# EAGLE design choobMatrix (EAGLE 9.0.1)

## Sheet 1 of 2
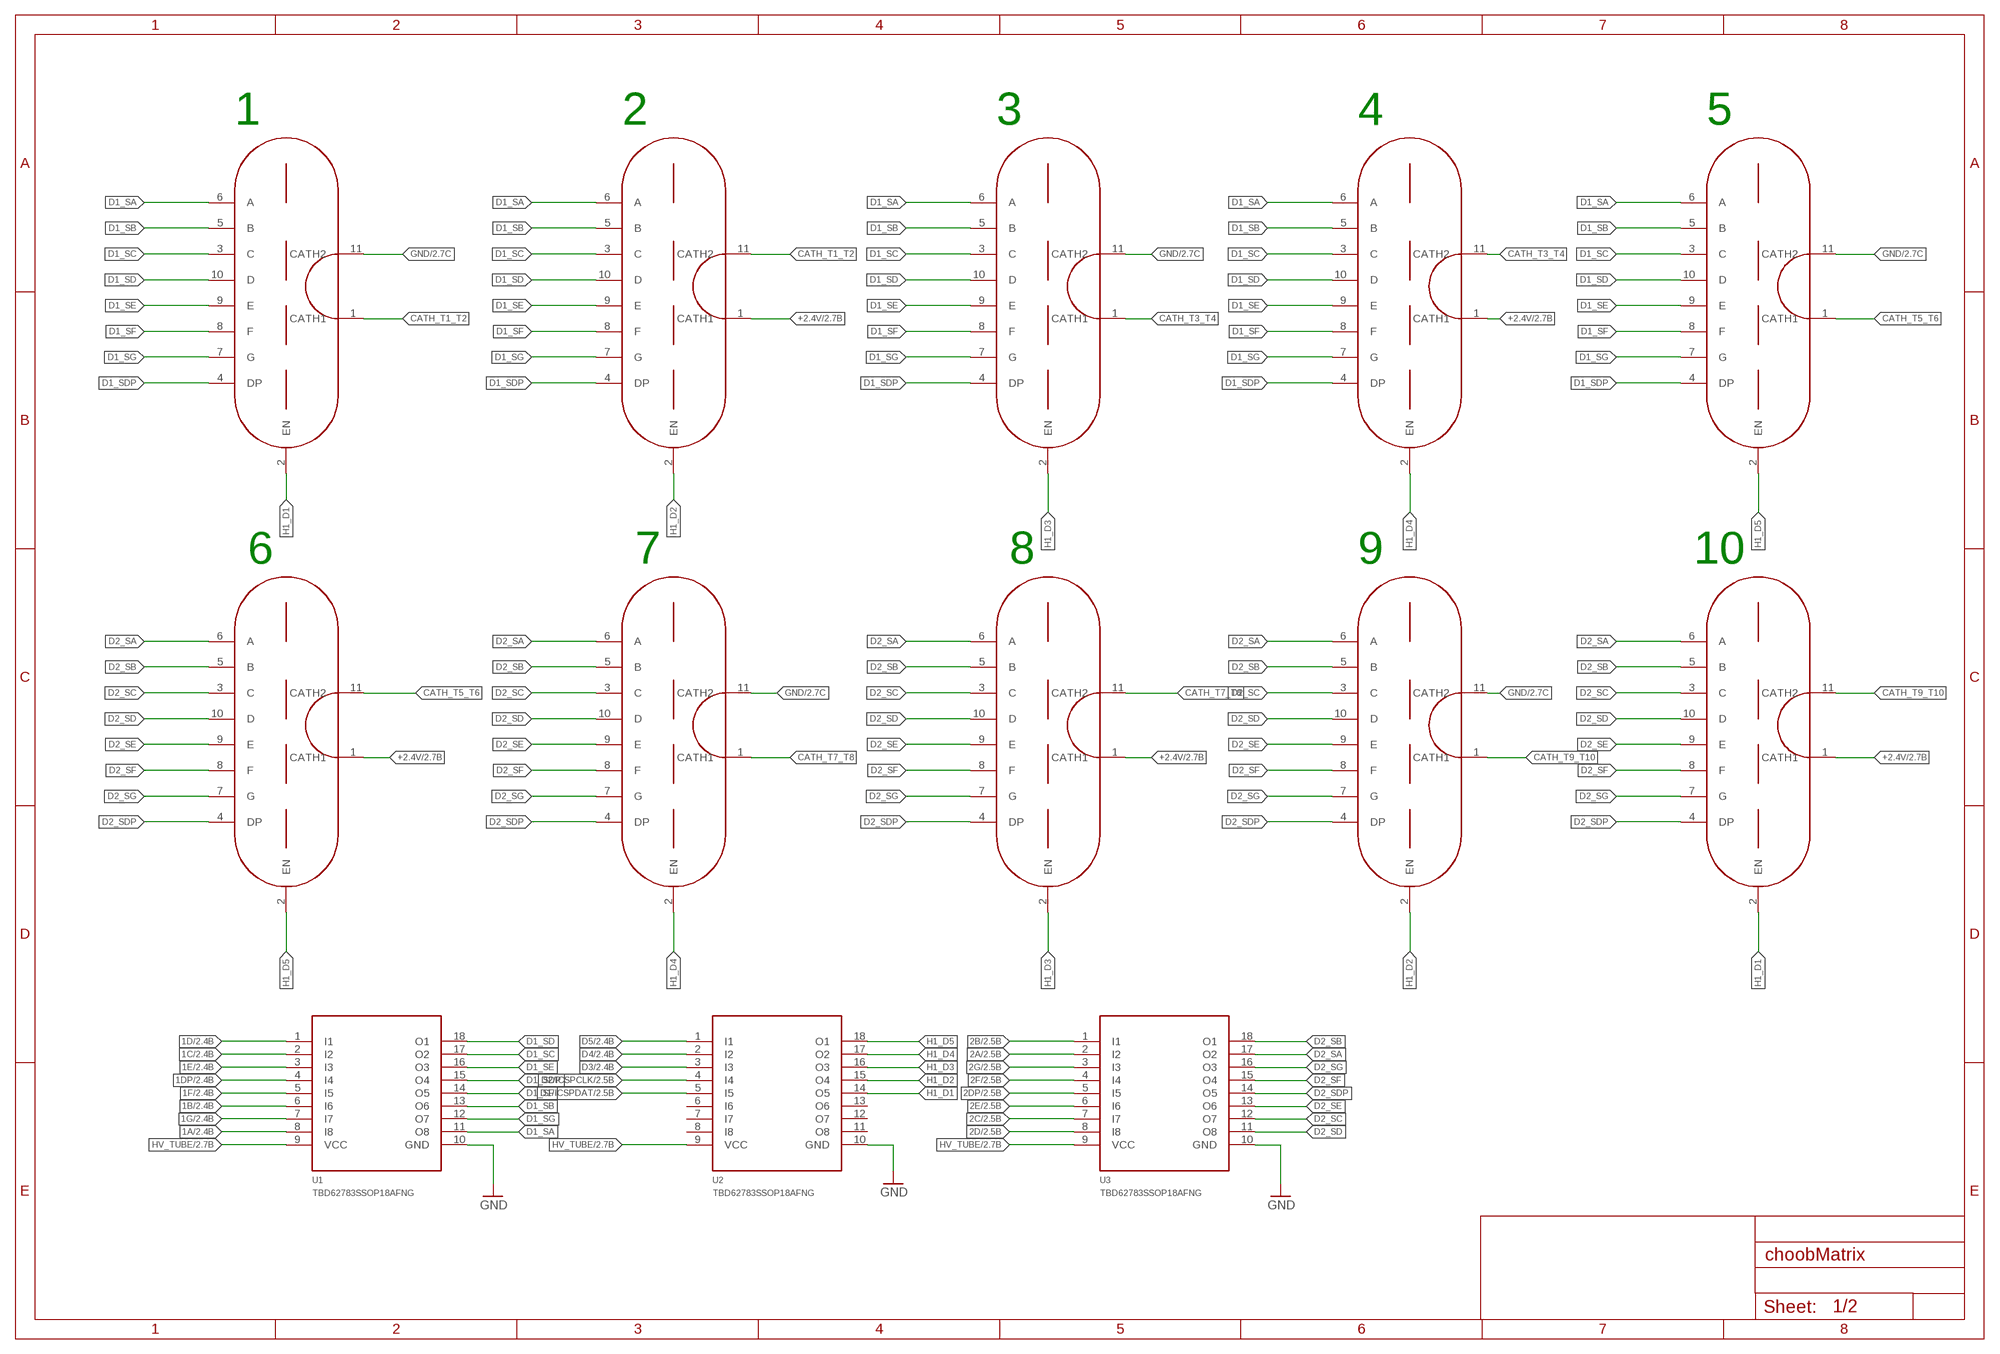
[diagram p0: schematic, sheet 1]

### Parts
T1  IV11  [IV11]
T2  IV11  [IV11]
T3  IV11  [IV11]
T4  IV11  [IV11]
T5  IV11  [IV11]
T6  IV11  [IV11]
T7  IV11  [IV11]
T8  IV11  [IV11]
T9  IV11  [IV11]
T10  IV11  [IV11]
U1  TBD62783SSOP18AFNG  [SOP65P640X15-18]
U2  TBD62783SSOP18AFNG  [SOP65P640X15-18]
U3  TBD62783SSOP18AFNG  [SOP65P640X15-18]

### Nets
1A: U1.8(I8) ; also sheet 2
1B: U1.6(I6) ; also sheet 2
1C: U1.2(I2) ; also sheet 2
1D: U1.1(I1) ; also sheet 2
1DP: U1.4(I4) ; also sheet 2
1E: U1.3(I3) ; also sheet 2
1F: U1.5(I5) ; also sheet 2
1G: U1.7(I7) ; also sheet 2
2A: U3.2(I2) ; also sheet 2
2B: U3.1(I1) ; also sheet 2
2C: U3.7(I7) ; also sheet 2
2D: U3.8(I8) ; also sheet 2
2DP: U3.5(I5) ; also sheet 2
2E: U3.6(I6) ; also sheet 2
2F: U3.4(I4) ; also sheet 2
2G: U3.3(I3) ; also sheet 2
+2.4V: T2.1(CATH1) T4.1(CATH1) T6.1(CATH1) T8.1(CATH1) T10.1(CATH1) ; also sheet 2
CATH_T1_T2: T1.1(CATH1) T2.11(CATH2)
CATH_T3_T4: T3.1(CATH1) T4.11(CATH2)
CATH_T5_T6: T5.1(CATH1) T6.11(CATH2)
CATH_T7_T8: T7.1(CATH1) T8.11(CATH2)
CATH_T9_T10: T9.1(CATH1) T10.11(CATH2)
D1/ICSPDAT: U2.5(I5) ; also sheet 2
D1_SA: T1.6(A) T2.6(A) T3.6(A) T4.6(A) T5.6(A) U1.11(O8)
D1_SB: T1.5(B) T2.5(B) T3.5(B) T4.5(B) T5.5(B) U1.13(O6)
D1_SC: T1.3(C) T2.3(C) T3.3(C) T4.3(C) T5.3(C) U1.17(O2)
D1_SD: T1.10(D) T2.10(D) T3.10(D) T4.10(D) T5.10(D) U1.18(O1)
D1_SDP: T1.4(DP) T2.4(DP) T3.4(DP) T4.4(DP) T5.4(DP) U1.15(O4)
D1_SE: T1.9(E) T2.9(E) T3.9(E) T4.9(E) T5.9(E) U1.16(O3)
D1_SF: T1.8(F) T2.8(F) T3.8(F) T4.8(F) T5.8(F) U1.14(O5)
D1_SG: T1.7(G) T2.7(G) T3.7(G) T4.7(G) T5.7(G) U1.12(O7)
D2/ICSPCLK: U2.4(I4) ; also sheet 2
D2_SA: T6.6(A) T7.6(A) T8.6(A) T9.6(A) T10.6(A) U3.17(O2)
D2_SB: T6.5(B) T7.5(B) T8.5(B) T9.5(B) T10.5(B) U3.18(O1)
D2_SC: T6.3(C) T7.3(C) T8.3(C) T9.3(C) T10.3(C) U3.12(O7)
D2_SD: T6.10(D) T7.10(D) T8.10(D) T9.10(D) T10.10(D) U3.11(O8)
D2_SDP: T6.4(DP) T7.4(DP) T8.4(DP) T9.4(DP) T10.4(DP) U3.14(O5)
D2_SE: T6.9(E) T7.9(E) T8.9(E) T9.9(E) T10.9(E) U3.13(O6)
D2_SF: T6.8(F) T7.8(F) T8.8(F) T9.8(F) T10.8(F) U3.15(O4)
D2_SG: T6.7(G) T7.7(G) T8.7(G) T9.7(G) T10.7(G) U3.16(O3)
D3: U2.3(I3) ; also sheet 2
D4: U2.2(I2) ; also sheet 2
D5: U2.1(I1) ; also sheet 2
GND: T1.11(CATH2) T3.11(CATH2) T5.11(CATH2) T7.11(CATH2) T9.11(CATH2) U1.10(GND) U2.10(GND) U3.10(GND) ; also sheet 2
H1_D1: T1.2(EN) T10.2(EN) U2.14(O5)
H1_D2: T2.2(EN) T9.2(EN) U2.15(O4)
H1_D3: T3.2(EN) T8.2(EN) U2.16(O3)
H1_D4: T4.2(EN) T7.2(EN) U2.17(O2)
H1_D5: T5.2(EN) T6.2(EN) U2.18(O1)
HV_TUBE: U1.9(VCC) U2.9(VCC) U3.9(VCC) ; also sheet 2
Unconnected: U2.6(I6) U2.7(I7) U2.8(I8) U2.11(O8) U2.12(O7) U2.13(O6)

### Notes on the sheet
- 1 | 2 | 3 | 4 | 5
- 6 | 7 | 8 | 9 | 10

## Sheet 2 of 2
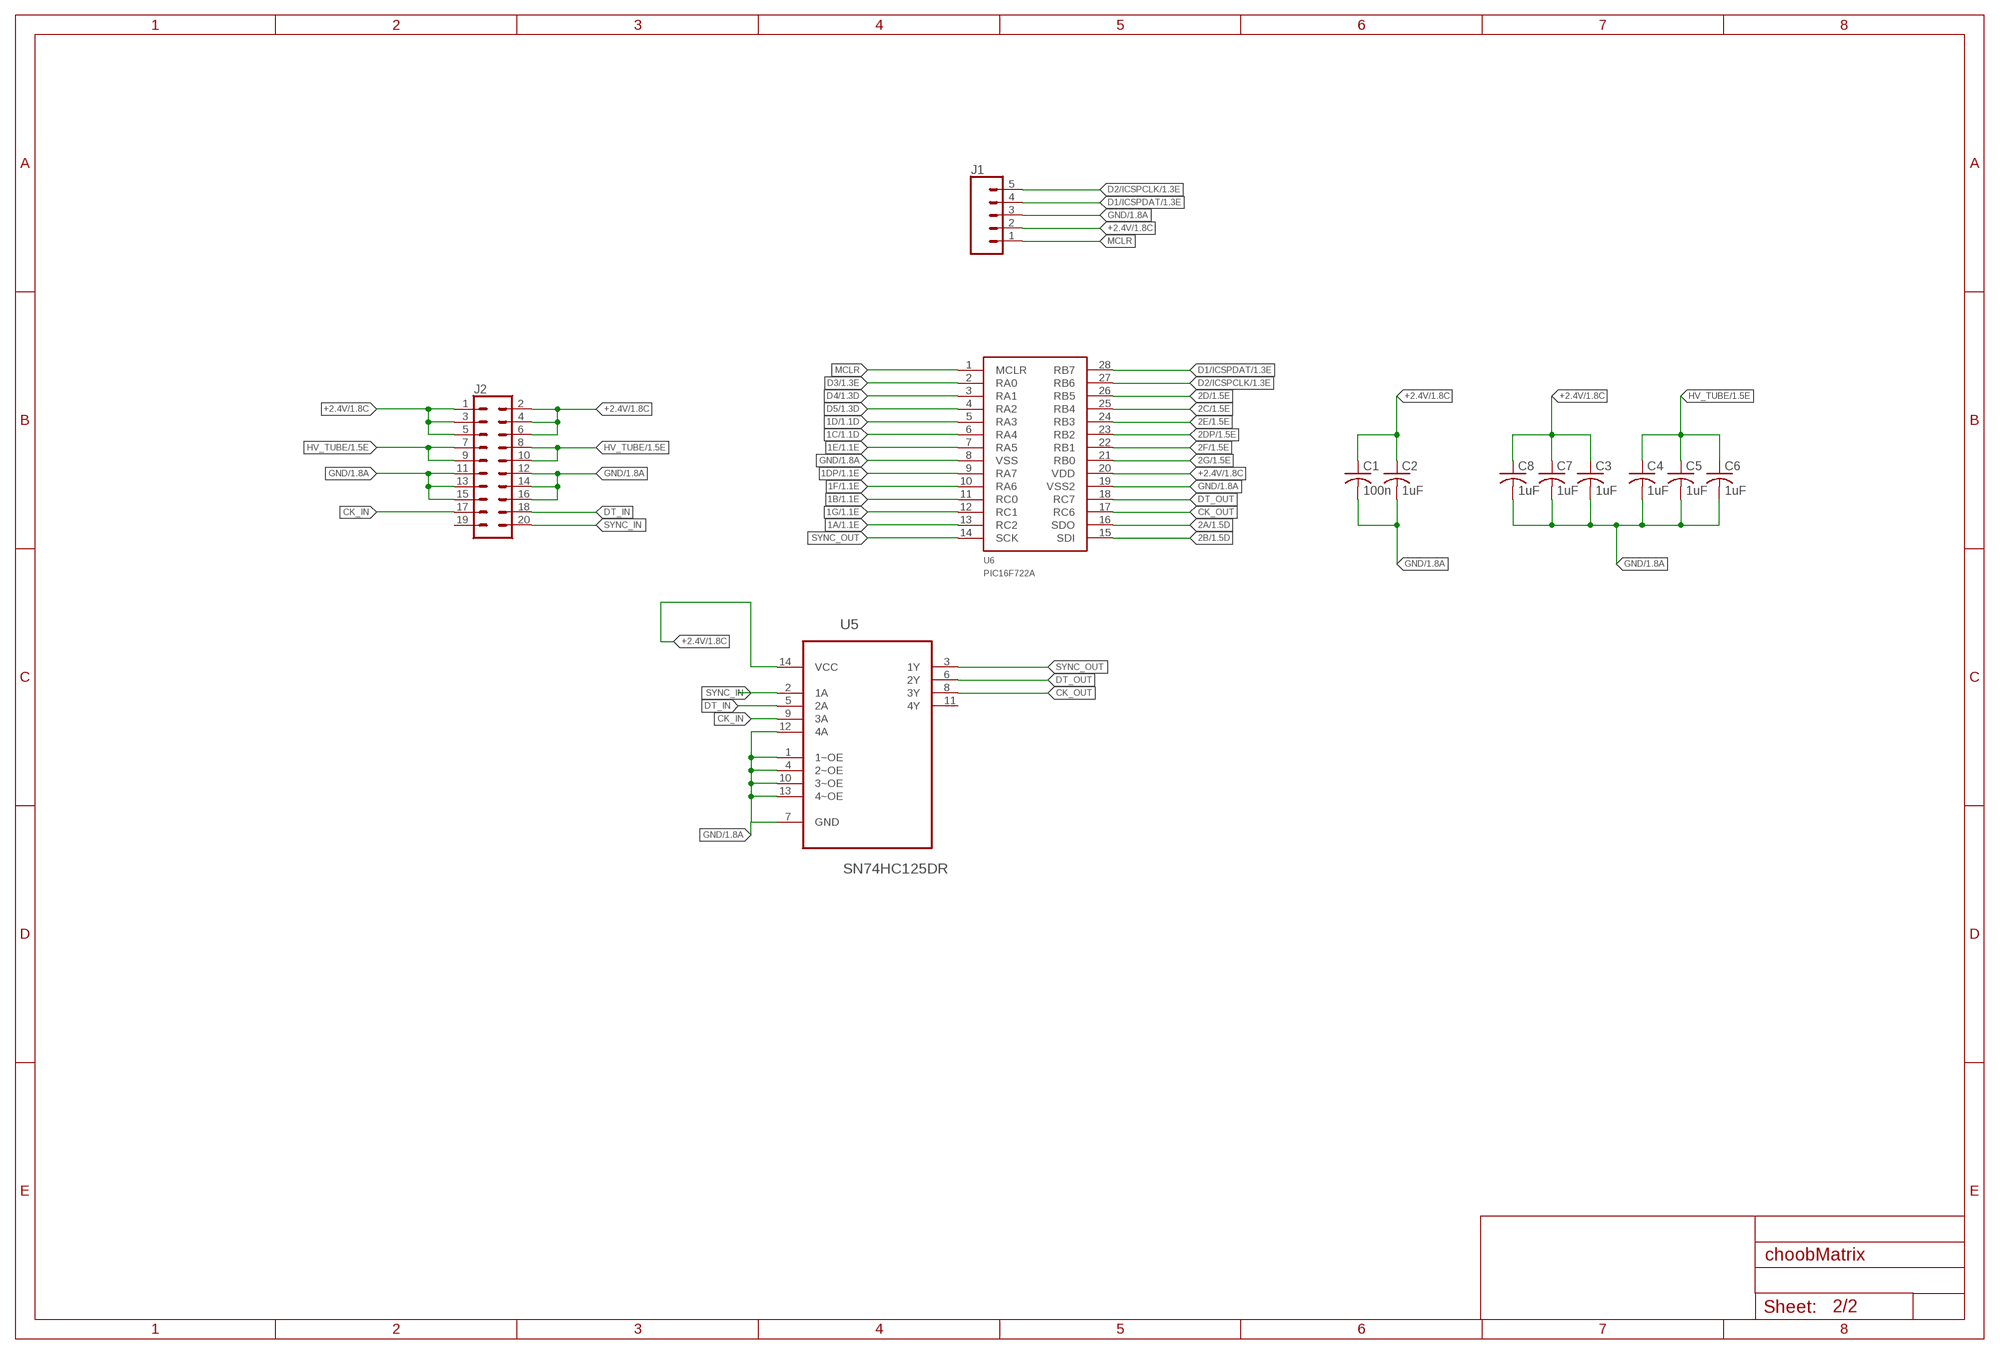
[diagram p1: schematic, sheet 2]

### Parts
C1  100n  C-USC0805K  [C0805K]
C2  1uF  C-USC0805K  [C0805K]
C3  1uF  C-USC0805K  [C0805K]
C4  1uF  C-USC0805K  [C0805K]
C5  1uF  C-USC0805K  [C0805K]
C6  1uF  C-USC0805K  [C0805K]
C7  1uF  C-USC0805K  [C0805K]
C8  1uF  C-USC0805K  [C0805K]
J1  CONN_05  [1X05]
J2  CONN_10X2NOSILK  [2X10_NOSILK]
U5  SN74HC125DR  [SOIC127P600X175-14N]
U6  PIC16F722A  [SOP65P780X200-28N]

### Nets
1A: U6.13(RC2) ; also sheet 1
1B: U6.11(RC0) ; also sheet 1
1C: U6.6(RA4) ; also sheet 1
1D: U6.5(RA3) ; also sheet 1
1DP: U6.9(RA7) ; also sheet 1
1E: U6.7(RA5) ; also sheet 1
1F: U6.10(RA6) ; also sheet 1
1G: U6.12(RC1) ; also sheet 1
2A: U6.16(SDO) ; also sheet 1
2B: U6.15(SDI) ; also sheet 1
2C: U6.25(RB4) ; also sheet 1
2D: U6.26(RB5) ; also sheet 1
2DP: U6.23(RB2) ; also sheet 1
2E: U6.24(RB3) ; also sheet 1
2F: U6.22(RB1) ; also sheet 1
2G: U6.21(RB0) ; also sheet 1
+2.4V: C1.1 C2.1 C3.1 C7.1 C8.1 J1.2 J2.1 J2.2 J2.3 J2.4 J2.5 J2.6 U5.14(VCC) U6.20(VDD) ; also sheet 1
CK_IN: J2.17 U5.9(3A)
CK_OUT: U5.8(3Y) U6.17(RC6)
D1/ICSPDAT: J1.4 U6.28(RB7) ; also sheet 1
D2/ICSPCLK: J1.5 U6.27(RB6) ; also sheet 1
D3: U6.2(RA0) ; also sheet 1
D4: U6.3(RA1) ; also sheet 1
D5: U6.4(RA2) ; also sheet 1
DT_IN: J2.18 U5.5(2A)
DT_OUT: U5.6(2Y) U6.18(RC7)
GND: C1.2 C2.2 C3.2 C4.2 C5.2 C6.2 C7.2 C8.2 J1.3 J2.11 J2.12 J2.13 J2.14 J2.15 J2.16 U5.1(1~OE) U5.4(2~OE) U5.7(GND) U5.10(3~OE) U5.12(4A) U5.13(4~OE) U6.8(VSS) U6.19(VSS2) ; also sheet 1
HV_TUBE: C4.1 C5.1 C6.1 J2.7 J2.8 J2.9 J2.10 ; also sheet 1
MCLR: J1.1 U6.1(MCLR)
SYNC_IN: J2.20 U5.2(1A)
SYNC_OUT: U5.3(1Y) U6.14(SCK)
Unconnected: J2.19 U5.11(4Y)

## Library data of the parts
C1-C8 = rcl:C-US: CAPACITOR, American symbol; SPICEPREFIX: C
J1 = SparkFun-Connectors:CONN_05: Multi connection point. Often used as Generic Header-pin footprint for 0.1 inch spaced/style header connections On any of the 0.1 inch spaced packages, you can populate with these: Break Away Headers - Straight <https://www.sparkfun.com/products/116> (PRT-00116) Break Away Male Headers - Right Angle <https://www.sparkfun.com/products/553> (PRT-00553) Female Headers <https://www.sparkfun.com/products/115> (PRT-00115) Break Away Headers - Machine Pin <https://www.sparkfun.com/products/117> (PRT-00117) Break Away Female Headers - Swiss Machine Pin <https://www.sparkfun.com/products/743> (PRT-00743) For SCREWTERMINALS and SPRING TERMINALS visit here: Screw Terimnals on SparkFun.com <https://www.sparkfun.com/search/results?term=Screw+Terminals> (5mm/3.5mm/2.54mm spacing) This device is also useful as a general connection point to wire up your design to another part of your project. Our various solder wires solder well into these plated through hole pads. Hook-Up Wire - Assortment (Stranded, 22 AWG) <https://www.sparkfun.com/products/11375> (PRT-11375) Hook-Up Wire - Assortment (Solid Core, 22 AWG) <https://www.sparkfun.com/products/11367> (PRT-11367) View the entire wire category on our website here <https://www.sparkfun.com/categories/141> Special notes: Molex polarized connector foot print use with SKU : PRT-08231 with associated crimp pins and housings. 1MM SMD Version SKU: PRT-10208
J2 = SparkFun-Connectors:CONN_10X2: Multi connection point. Often used as Generic Header-pin footprint for 0.1 inch spaced/style header connections On any of the 0.1 inch spaced packages, you can populate with these: Break Away Headers - Straight <https://www.sparkfun.com/products/116> (PRT-00116) Break Away Male Headers - Right Angle <https://www.sparkfun.com/products/553> (PRT-00553) Female Headers <https://www.sparkfun.com/products/115> (PRT-00115) Break Away Headers - Machine Pin <https://www.sparkfun.com/products/117> (PRT-00117) Break Away Female Headers - Swiss Machine Pin <https://www.sparkfun.com/products/743> (PRT-00743) Special note about the "SPECIAL" package: This was SPECIALLY designed to be used with our Graphic LCD Backpack. Be sure you want to use this! It is not only staggered on each line of header holes, but IT IS ALSO offset of the center point of the top and bottom lines by 5 mil. This causes the headers to lock into place on the "standard" footprint on the LCD screen. The extra squares on the tdocu layer are there simply to reference other pins (if you were to actually populate a longer header than ten long - this is what we do with the backpacks).
T1-T10 = iv11:IV11
U1-U3 = SSOP18:TBD62783
U5 = driver:SN74HC125DR: QUADRUPLE BUS BUFFER GATES WITH 3-STATE OUTPUTS; AVAILABILITY: Good; DESCRIPTION: Quadruple Bus Buffer Gates With 3-State Outputs 14-SOIC -40 to 85; MF: Texas Instruments; MP: SN74HC125DR; PACKAGE: SOIC-14 Texas Instruments; PRICE: 0.17 USD
U6 = SOP65P780X200-28N:PIC16F722A

## Board
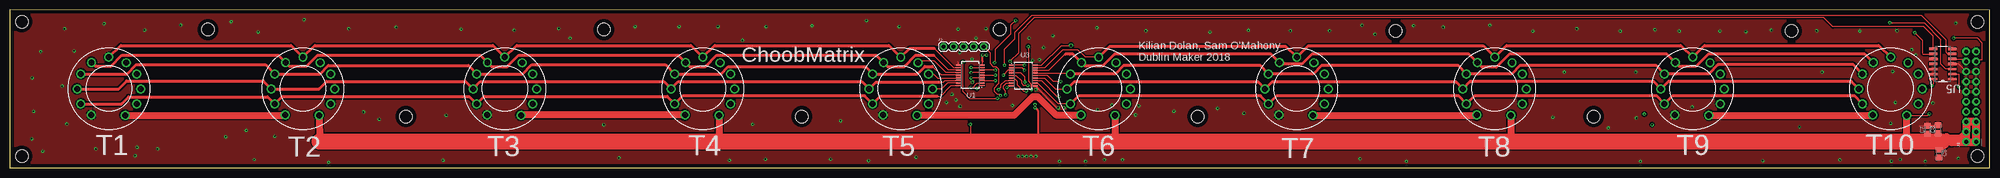
[diagram p2: board, top side]
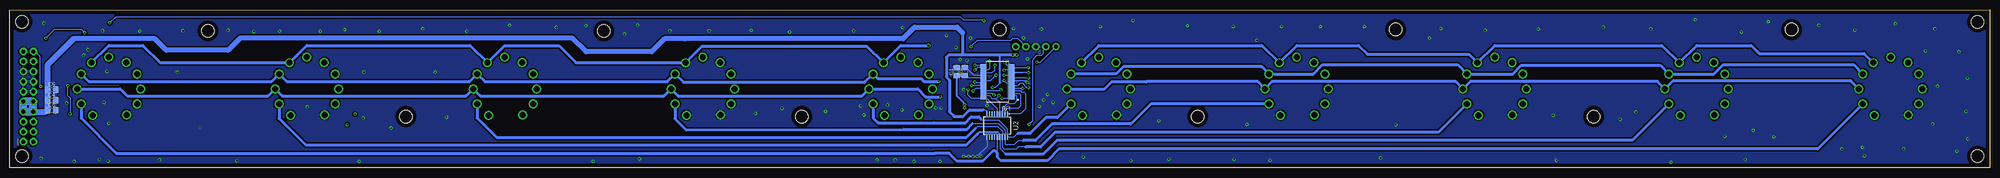
[diagram p3: board, bottom side, seen from below]

Size 500 x 40 mm. Coordinates in mm from the lower left corner, seen from the top.
Outline: 0,0 500,0 499.99,39.97 0,40 0,0
Copper layers (1*16): Top 0.035mm / dielectric 1.5mm / Bottom 0.035mm
Design rules "default *": minimum track width 6mil, minimum drill 0.35mm, track to track 13mil, track to pad 6mil, pad to pad 6mil, via to via 12mil, smd to smd 6mil, copper to edge 40mil, drill to drill 6mil, minimum pad ring 10mil, minimum via ring 8mil, stop-mask expansion 4mil, vias tented up to drill 0mil, thermal gap 10mil
Holes 3.2 mm at 497,3 497,37 3,3 3,37 50,35 100,13 150,35 200,13 250,35 300,13 350,34.7 400,13 450,34.7

### Footprints (pad centres in the part's own frame; a part is rotated, then mirrored left to right if it is on the bottom)
C0805K = smd 1.3 x 1.6: 1 -1,0; 2 1,0
1X05 = drill 1.016 pad 1.88: 1 0,0; 2 2.54,0; 3 5.08,0; 4 7.62,0; 5 10.16,0
2X10_NOSILK = drill 1.016 pad 1.88: 1 0,0; 2 0,2.54; 3 2.54,0; 4 2.54,2.54; 5 5.08,0; 6 5.08,2.54; 7 7.62,0; 8 7.62,2.54; 9 10.16,0; 10 10.16,2.54; 11 12.7,0; 12 12.7,2.54; 13 15.24,0; 14 15.24,2.54; 15 17.78,0; 16 17.78,2.54; 17 20.32,0; 18 20.32,2.54; 19 22.86,0; 20 22.86,2.54
IV11 = drill 1.5: 1 4.1,-6.7; 2 7,-3.8; 3 8,0; 4 7,3.8; 5 4.4,6.6; 6 0,8; 7 -4.4,6.7; 8 -7.1,3.8; 9 -8,0; 10 -7.1,-3.8; 11 -4.5,-6.6
SOP65P640X15-18 = smd 1.229 x 0.302: 1 -2.991,2.6; 2 -2.991,1.95; 3 -2.991,1.3; 4 -2.991,0.65; 5 -2.991,0; 6 -2.991,-0.65; 7 -2.991,-1.3; 8 -2.991,-1.95; 9 -2.991,-2.6; 10 2.991,-2.6; 11 2.991,-1.95; 12 2.991,-1.3; 13 2.991,-0.65; 14 2.991,0; 15 2.991,0.65; 16 2.991,1.3; 17 2.991,1.95; 18 2.991,2.6
SOIC127P600X175-14N = smd 2.057 x 0.61: 1 -4.801,7.62; 2 -4.801,6.35; 3 -4.801,5.08; 4 -4.801,3.81; 5 -4.801,2.54; 6 -4.801,1.27; 7 -4.801,0; 8 0,0; 9 0,1.27; 10 0,2.54; 11 0,3.81; 12 0,5.08; 13 0,6.35; 14 0,7.62
SOP65P780X200-28N = smd 1.651 x 0.432: 1 -3.505,4.225; 2 -3.505,3.575; 3 -3.505,2.925; 4 -3.505,2.275; 5 -3.505,1.625; 6 -3.505,0.975; 7 -3.505,0.325; 8 -3.505,-0.325; 9 -3.505,-0.975; 10 -3.505,-1.625; 11 -3.505,-2.275; 12 -3.505,-2.925; 13 -3.505,-3.575; 14 -3.505,-4.225; 15 3.505,-4.225; 16 3.505,-3.575; 17 3.505,-2.925; 18 3.505,-2.275; 19 3.505,-1.625; 20 3.505,-0.975; 21 3.505,-0.325; 22 3.505,0.325; 23 3.505,0.975; 24 3.505,1.625; 25 3.505,2.275; 26 3.505,2.925; 27 3.505,3.575; 28 3.505,4.225

### Placement (x,y rotation side)
C1  260.9,24.4 90 bottom
C2  258.8,24.4 90 bottom
C3  487,9.8 90 top
C4  489.4,17.1 0 bottom
C5  489.4,19.8 0 bottom
C6  489.4,14.6 0 bottom
C7  484.3,9.7 90 top
C8  487.2,3.6 270 top
J1  235.8,30.7 0 top
J2  496.6,6.6 90 top
T1  25,20 0 top
T2  74,20 0 top
T3  125,20 0 top
T4  175,20 0 top
T5  225,20 0 top
T6  275,20 0 top
T7  325,20 0 top
T8  375,20 0 top
T9  425,20 0 top
T10  475,20 0 top
U1  242.58,23.45 180 top
U2  250.65,10.69 270 bottom
U3  255.9,23.4 0 top
U5  485.8,30.1 180 top
U6  250.6,21.8 180 bottom

### Tracks (layer width: path | path; a pad name or v marks a point on that pad's centre or on a via)
1A  (via drill 0.35)
  Top 0.3: v242.8,25.4 U1.8
  Bottom 0.3: U6.13 242.82,25.38 v242.8,25.4
1B  (via drill 0.35)
  Top 0.3: 243.7,24.1 U1.6 v242.8,24.1
  Bottom 0.3: 244.18,24.07 U6.11 242.82,24.07 v242.8,24.1
1C  (via drill 0.35)
  Top 0.3: U1.2 244.3,21.5 243.2,20.4 v242.8,20.4
  Bottom 0.3: U6.6 245.38,20.82 244.7,21.5 244.3,21.5 243.2,20.4 v242.8,20.4
1D  (via drill 0.35)
  Top 0.3: v244.2,20.1 244.95,20.85 U1.1
  Bottom 0.3: U6.5 244.28,20.18 v244.2,20.1
1DP  (via drill 0.35)
  Top 0.3: U1.4 244.2,22.8 v242.8,22.8
  Bottom 0.3: v242.8,22.8 247.07,22.8 U6.9
1E  (via drill 0.35)
  Top 0.3: U1.3 246.7,22.15 247.1,22.15 248.85,22.15 v248.9,22.1
  Bottom 0.3: v248.9,22.1 248.28,21.48 U6.7
1F  (via drill 0.35)
  Top 0.3: U1.5 248.85,23.45 v248.9,23.5
  Bottom 0.3: U6.10 248.82,23.43 v248.9,23.5
1G  (via drill 0.35)
  Top 0.3: v248.9,24.7 248.85,24.75 U1.7
  Bottom 0.3: U6.12 248.88,24.73 v248.9,24.7
2A  (via drill 0.35)
  Top 0.3: U3.2 255.65,25.35 v256.3,24.7
  Bottom 0.3: U6.16 255.62,25.38 v256.3,24.7
2B  (via drill 0.35)
  Top 0.3: v256.3,26 U3.1
  Bottom 0.3: v256.3,26 256.27,26.02 U6.15
2C  (via drill 0.35)
  Top 0.3: U3.7 251.4,22.1 250.36,21.06 250.36,21.03 250.34,21.01 250.34,20.44 v249.7,19.8
  Bottom 0.3: v249.7,19.8 249.97,19.52 U6.25
2D  (via drill 0.35)
  Top 0.3: U3.8 251.67,21.45 250.97,20.75 250.97,20.05 251.5,19.52 v251.5,18.4
  Bottom 0.3: v251.5,18.4 251.97,18.88 U6.26
2DP  (via drill 0.35)
  Top 0.3: v257.1,20.9 256,20.9 255.45,21.45 255.45,22.05 254.1,23.4 U3.5
  Bottom 0.3: U6.23 257.02,20.82 v257.1,20.9
2E  (via drill 0.35)
  Top 0.3: U3.6 253.65,22.75 254.4,22 254.4,21.1 256,19.5 v256.7,19.5
  Bottom 0.3: v256.7,19.5 256.02,20.18 U6.24
2F  (via drill 0.35)
  Top 0.3: U3.4 255.35,24.05 256.35,23.05 v256.35,21.73
  Bottom 0.3: v256.35,21.73 256.09,21.48 U6.22
2G  (via drill 0.35)
  Top 0.3: U3.3 252.1,24.7 v250.9,23.5
  Bottom 0.3: v250.9,23.5 252.29,22.11 U6.21
+2.4V  (via drill 0.35)
  Top 0.3: 487.2,4.9 C8.1 | 488,6.7 486.3,6.7 C7.1 | C3.1 487,8 485.7,6.7 | v242.6,11 242.6,6.7 | T10.1 484.4,13.3 v484.8,13.7 | U5.14 485.8,21.25 v485.35,20.8
  Top 0.5: 259.6,7.6 259.6,14.5 v258.9,15.2 v258.9,16 | 259.6,7.6 259.3,7.3 | 259.6,7.6 259.6,6.9 259.4,6.7
  Top 1.3: J2.4 492.62,7.7 489.2,7.7 489.1,7.8 | 488,6.7 487.2,5.9 487.2,4.9
  Top 1.8: T2.1 78.2,6.7 | 479.1,6.7 T10.1 | T8.1 379.1,6.9 378.9,6.7 | T6.1 279.1,7 279.4,6.7 | T4.1 179.1,6.8 179.2,6.7
  Top 2: 488,6.7 490.46,6.7 J2.2 J2.4 J2.6 J2.5 J2.3 J2.1 490.4,6.5 489.1,7.8
  Top 4: 78.2,6.7 179.2,6.7 242.6,6.7 259.4,6.7 279.4,6.7 378.9,6.7 479.1,6.7 485.7,6.7 488,6.7
  Bottom 0.3: J1.2 239.07,29.97 239.07,28.86 239.56,28.37 240.67,28.37 241.7,27.34 241.7,11.9 v242.6,11 | 254.38,22.74 254.37,22.75 254.1,22.75 U6.20 258.18,22.77 C2.1 | v484.8,13.7 484.8,17.7 485.35,18.25 v485.35,20.8
  Bottom 0.5: C2.1 C1.1 260.9,18.3 258.9,16.3 v258.9,16
CATH_T1_T2
  Top 1.8: T1.1 69.4,13.3 T2.11
CATH_T3_T4
  Top 1.8: T4.11 129.2,13.4 T3.1
CATH_T5_T6
  Top 1.8: T6.11 264.2,13.4 259.6,18 258.3,18 253.6,13.3 T5.1
CATH_T7_T8
  Top 1.8: T7.1 370.4,13.3 T8.11
CATH_T9_T10
  Top 1.8: T9.1 470.4,13.3 T10.11
CK_IN  (via drill 0.35)
  Top 0.3: J2.17 497.08,27.4 498.2,27.4 498.2,31.6 497,32.8 v490.9,32.8 | v481.1,34.2 483,32.3 483,29 483.17,28.83 U5.9
  Bottom 0.3: v481.1,34.2 481.85,34.95 488.75,34.95 v490.9,32.8
CK_OUT  (via drill 0.35)
  Top 0.3: v252.6,27 254.7,29.1 254.7,34 258.7,38 458.1,38 460.4,35.7 483.4,35.7 485.8,33.3 U5.8
  Bottom 0.3: v252.6,27 252.6,25.1 253,24.7 254.09,24.7 U6.17
D1/ICSPDAT  (via drill 0.35)
  Top 0.3: v257.2,30.7 257.2,21.98 257.93,21.25 257.93,19.97 v258,19.9
  Bottom 0.3: J1.4 245.42,32.7 246.8,32.7 247.3,32.2 255.8,32.2 257.2,30.8 v257.2,30.7 | v258,19.9 258,18.4 257.18,17.57 U6.28 253.2,17.57 250.65,15.03 U2.5
D1_SA
  Top 0.3: 233.4,30.3 238.3,25.4 U1.11
  Top 0.8: T1.6 28,31 71,31 T2.6 77,31 122,31 T3.6 128,31 172,31 T4.6 178,31 222,31 T5.6 227.3,30.3 233.4,30.3
D1_SB
  Top 0.3: T5.5 229.8,27 233.5,27 236.4,24.1 U1.13
  Bottom 0.8: T5.5 225,31 183.8,31 T4.5 175,31 159.4,31 157.15,28.75 131.55,28.75 T3.5 125,31 82.8,31 T2.5 74,31 60.2,31 58.15,28.95 31.75,28.95 T1.5
D1_SC
  Top 0.3: U1.17 236.8,21.5 235.3,20 T5.3
  Bottom 0.8: T5.3 223.5,20 221.8,21.7 213,21.7 212.9,21.8 184.8,21.8 T4.3 181.2,21.8 134.8,21.8 T3.3 131.1,21.9 83.9,21.9 T2.3 80,22 35,22 T1.3
D1_SD
  Top 0.3: 234.2,18.1 235,18.1 237.75,20.85 U1.18
  Top 0.8: T1.10 28.2,16.2 30,18 65.1,18 T2.10 68.7,18 116.1,18 T3.10 119.8,18.1 166,18.1 T4.10 169.9,18.2 215.9,18.2 T5.10 219.8,18.1 234.2,18.1
D1_SDP
  Top 0.3: U1.15 234.3,22.8 233.3,23.8 T5.4
  Bottom 0.8: T5.4 220.6,23.8 218.8,25.6 183.8,25.6 T4.4 170.8,23.8 168.5,26.1 134.3,26.1 T3.4 120.4,23.8 118.2,26 83.2,26 T2.4 69.6,23.8 67.3,26.1 34.3,26.1 T1.4
D1_SE
  Top 0.3: U1.16 236.2,22.15 235.75,21.7 234.7,21.7
  Top 0.8: T1.9 27.5,20 29.5,22 64,22 T2.9 78.1,20 80,21.9 115.1,21.9 T3.9 118.8,21.8 165.2,21.8 T4.9 168.8,21.8 215.2,21.8 T5.9 218.7,21.7 234.7,21.7
D1_SF
  Top 0.3: U1.14 235.25,23.45 233,25.7
  Top 0.8: T1.8 29.6,23.8 31.9,26.1 64.6,26.1 T2.8 78.3,23.8 80.4,25.9 115.8,25.9 T3.8 129.5,23.8 131.8,26.1 165.6,26.1 T4.8 170.5,23.8 179.6,23.8 181.4,25.6 216.1,25.6 T5.8 229.2,23.8 231.1,25.7 233,25.7
D1_SG
  Top 0.3: U1.12 237.05,24.75 233.3,28.5
  Top 0.8: T1.7 21.5,25.8 25.6,25.8 28.3,28.5 67.8,28.5 T2.7 70.5,25.8 75,25.8 77.7,28.5 118.8,28.5 T3.7 121.7,25.6 125.6,25.6 128.5,28.5 168.8,28.5 T4.7 171.6,25.7 175.7,25.7 178.5,28.5 218.8,28.5 T5.7 221.6,25.7 225.9,25.7 228.7,28.5 233.3,28.5
D2/ICSPCLK  (via drill 0.35)
  Top 0.3: v250.2,18.3 249.9,18.6 249.4,18.6 248.7,19.3 248.7,20.26 249.73,21.29 249.73,25.05 249.11,25.67 248.35,25.67 247.53,26.49 247.53,29.13 J1.5
  Bottom 0.3: 251,17.5 251.8,17.5 252.53,18.23 U6.27 | 251,17.5 v250.2,18.3 | U2.4 250,16.5 251,17.5
D2_SA
  Top 0.3: T6.6 271.6,28 269.8,29.8 265.9,29.8 261.45,25.35 U3.17
  Top 0.8: T6.6 277.8,30.8 322.2,30.8 T7.6 327.9,30.9 372.1,30.9 T8.6 378,31 422,31 T9.6 428,31 472,31 T10.6
D2_SB  (via drill 0.5)
  Top 0.3: v268,31 265.6,31 260.6,26 U3.18
  Bottom 0.8: T10.5 475,31 466.4,31 462,26.6 T9.5 425,31 383.8,31 T8.5 375.1,30.9 361.3,30.9 357,26.6 T7.5 325.2,30.8 283.6,30.8 T6.5 275,31 v268,31
D2_SC  (via drill 0.35)
  Top 0.3: U3.12 260.5,22.1 264.6,18 v265,18
  Bottom 0.8: T10.3 472.2,20 470.4,18.2 434.8,18.2 T9.3 431.2,18.2 384.8,18.2 T8.3 381.2,18.2 334.8,18.2 T7.3 331.2,18.2 284.8,18.2 T6.3 270.7,20 268.7,18 v265,18
D2_SD
  Top 0.3: T6.10 264.8,16.2 259.55,21.45 U3.11
  Top 0.8: T6.10 268.65,16.95 269.6,17.9 269.9,18.2 315.9,18.2 T7.10 319.9,18.2 365.9,18.2 T8.10 369.9,18.2 415.9,18.2 T9.10 419.9,18.2 465.9,18.2 T10.10
D2_SDP  (via drill 0.35)
  Top 0.3: U3.14 262.1,23.4 263.6,21.9 v265.4,21.9
  Bottom 0.8: T10.4 480.1,21.9 433.9,21.9 T9.4 430.1,21.9 383.9,21.9 T8.4 380,21.8 334,21.8 T7.4 329.9,21.7 284.1,21.7 T6.4 280.8,22.6 269.78,22.6 269.08,21.9 v265.4,21.9
D2_SE
  Top 0.3: U3.13 261.35,22.75 264.1,20 T6.9
  Top 0.8: T10.9 465.1,21.9 418.9,21.9 T9.9 415.2,21.8 368.8,21.8 T8.9 365.3,21.7 318.7,21.7 T7.9 315.3,21.7 268.7,21.7 T6.9
D2_SF
  Top 0.3: U3.15 267.65,24.05 T6.8
  Top 0.8: 466.2,25.5 T10.8 465.6,26.1 431.4,26.1 429.1,23.8 T9.8 415.8,25.9 381.4,25.9 379.3,23.8 T8.8 365.8,25.9 331.3,25.9 329.2,23.8 T7.8 315.8,25.9 281.3,25.9 279.2,23.8 T6.8
D2_SG
  Top 0.3: U3.16 262.4,24.7 266.5,28.8 267.7,28.8
  Top 0.8: T10.7 468.5,28.8 428.9,28.8 425.8,25.7 421.6,25.7 T9.7 418.5,28.8 378.7,28.8 375.4,25.5 371.8,25.5 T8.7 368.5,28.8 328.8,28.8 326.3,26.3 321,26.3 T7.7 318.5,28.8 279,28.8 276,25.8 271.5,25.8 T6.7 268.5,28.8 267.7,28.8 266.6,28.8
D3
  Bottom 0.3: U2.3 249.35,15.05 248.1,16.3 246.3,16.3 245.7,16.9 245.7,18.2 246.83,18.2 247.07,18.2 U6.2
D4
  Bottom 0.3: U2.2 248.7,14.4 248.1,15 245.4,15 244.7,15.7 244.7,18.6 244.74,18.64 244.81,18.64 245.04,18.88 U6.3
D5
  Bottom 0.3: U2.1 244.72,13.68 243.5,14.9 243.5,18.9 243.87,19.27 244.54,19.27 244.8,19.52 U6.4
DT_IN
  Top 0.3: U5.5 493.42,27.56 J2.18
DT_OUT  (via drill 0.35)
  Top 0.3: v251.2,26 251.2,30.03 253.84,32.66 253.84,34.37 258.17,38.7 482.7,38.7 488.9,32.5 488.9,29.4 489.47,28.83 U5.6
  Bottom 0.3: U6.18 251.93,24.07 251.2,24.8 v251.2,26
GND  (via drill 0.35)
  Top 0.3: v255.7,2.9 v256.8,2.9 | v257.9,2.9 v259.1,2.9 | U3.10 264.49,15.2 v264.8,15.2 | U1.10 239.59,26.71 239.4,26.9 | C7.2 486.9,10.7 482.29,10.51 | J2.16 492.15,26.29 U5.4
  Top 0.6: 419.6,12.5 T9.11
  Bottom 0.3: U2.10 253.25,5.35 v255.7,2.9 | v256.8,2.9 v257.9,2.9 | v259.1,2.9 v254.7,2.9 | U6.8 244.97,22.12 244.96,22.13 243.63,22.13 243,21.5 242.4,21.5 | C2.2 258.5,25.4 256.5,23.41 256.49,23.43 U6.19
  other vias: 354.5,36 362,35.6 373.8,36.1 476.6,34.7 467.2,34.6 456.3,34.7 457.7,24.2 475.5,24.4 481.4,28.5 485.7,16.4 476.2,16.6 475,11.3 477.4,2.1 452,10.4 424.9,15.4 410.8,12.6 410.6,24.2 438.4,34.5 431.9,34.6 421.6,34.6 415.5,35 406.7,34.6 444.9,34.8 384.6,34.6 395.7,35.2 403.7,10.1 389.7,12.8 392.6,24.2 341.5,36.1 344.8,33.8 323.4,34.7 333.3,34.7 312.8,34.8 303.1,34.4 286.9,34.7 274.5,35.5 263.4,33.5 239.5,35.1 244,32.9 224.6,35.8 216.3,37.3 202.6,36 191,35.8 178.8,35.8 169,35.8 157.9,35.8 185,32.3 138.6,35.3 141.5,32.8 127.4,34.8 114,35.1 97.6,35.6 85.6,35.2 74.3,37.5 62.7,34.4 55.9,37 43.1,36.1 23.8,36.5 13.8,35.2 7.8,29.4 34,34.9 16.2,29.6 5.6,22.8 13.2,20.7 6,14.3 14.4,11.1 5.5,7.4 21.7,4.8 8.3,4.2 32.1,5.2 37.3,4.8 54.5,7.9 61.7,2.1 66.9,8 80.5,1.4 93.3,12.3 110.2,13.3 109.4,1.9 150,10.9 153.8,2.5 187.6,11 181.7,1.9 209.8,11.9 207.3,2.2 228.9,2.7 89.3,14.1 59.7,9.5 239.9,29.2 238.9,17.2 281,2 276.4,2 216.9,1.8 190.8,2.2 31.6,3.1 265.1,1.6 271.7,1.6 341,2.3 352.7,1.6 411.8,1.6 462.2,2 442.7,1.8 475.2,1.7 483.8,1.6 492.1,2.4 491.4,36.6 480.3,29.9 246.5,35.3 258.3,27.2 260,27.4 257.4,32.9 261.1,30.5 243,27.6 274.7,14.7 278.4,15.9 284.3,13.4 285.1,15.7 305,15.1 311.7,13.8 294,14.3 243.1,21.7 236.5,16.6 237.9,18.6 240,15.6 266.2,15.2 259.1,19.8 253.2,15.8
  pour Bottom: 500,0 0,0 0,40 500,40
  pour Top: 0,0 71.7,0 499.9,-0.1 500,14.7 500,40 0,40
H1_D1
  Bottom 0.3: U2.14 250.65,4.3 | 250.65,4.3 250.65,3.8 250.65,3.6 | 266.3,3.7 267,3.7 | 251.7,4.3 250.65,4.3
  Bottom 0.8: 37.3,10.9 T1.2 43.4,4.8 235,4.8 238,1.8 249.7,1.8 250.65,2.75 250.65,3.6 | T10.2 482,12.6 473.1,3.7 266.3,3.7 262.8,3.7 260.8,1.7 254.3,1.7 251.7,4.3 251.15,4.3 250.65,3.8
H1_D2
  Bottom 0.3: 248.5,3.5 248.6,3.5 250,4.9 U2.15 250,8.5 250.5,9
  Bottom 0.5: 250.5,9 255.2,9 255.6,8.6
  Bottom 0.8: T2.2 90.2,7 235.5,7 239,3.5 248.5,3.5 | T9.2 432,12.5 425.2,5.7 258.5,5.7 255.6,8.6
H1_D3
  Bottom 0.3: 256.2,9.9 255.7,10.4 250.4,10.4 249.35,9.35 U2.16 249.35,5.25 248.75,4.65 245.9,4.65 245.25,5.3 243.4,5.3
  Bottom 0.8: T8.2 382,12.6 377,7.6 258.5,7.6 256.2,9.9 | T3.2 139.2,9 236,9 239.7,5.3 243.4,5.3
H1_D4
  Bottom 0.3: 244.05,6.95 244.15,6.85 245.35,6.85 246.4,5.8 248.4,5.8 248.7,6.1 U2.17 248.7,9.6 250.3,11.2 256.9,11.2
  Bottom 0.8: T4.2 211.8,16.2 216.9,11.1 236.8,11.1 240.95,6.95 244.05,6.95 | T7.2 332,12.4 329.2,9.6 274.3,9.8 258.3,9.8 256.9,11.2
H1_D5
  Bottom 0.3: 245.5,8.7 246.5,7.7 U2.18 248.05,9.85 250.2,12 254.4,12 254.75,12.35 | 266.7,11.4 267.2,11.4
  Bottom 0.8: T5.2 235.45,12.75 238.3,12.75 242.35,8.7 245.5,8.7 | T6.2 282,12.7 280.7,11.4 266.7,11.4 258.7,11.4 257.2,12.9 255.3,12.9 254.75,12.35
HV_TUBE  (via drill 0.35)
  Top 0.3: U1.9 245.7,26.18 245.7,27 | v251.8,20.4 252.2,20.8 U3.9
  Top 0.4: v245.7,28.6 v246.7,28.6
  Top 0.5: 245.7,27 v245.7,28.6
  Bottom 0.3: U2.9 253.25,14.45 253.5,14.7 254.2,14.7 | 261.6,13.1 261.5,13 | C5.1 490.4,14.8 C6.1 C4.1 | v251.8,20.4 251.47,20.4 251.41,20.46 250.94,20.46 249.9,21.5
  Bottom 0.5: 249.9,21.5 249.9,28.6 249.9,28.7
  Bottom 0.8: 261.5,13 259.3,13 257.6,14.7 254.2,14.7 | v245.7,28.6 249.9,28.6 259.4,28.6 | 259.4,28.6 262.9,28.6 263.5,28 263.5,23 262.7,22.2 262.7,14.2 261.6,13.1 | 259.35,34.2 259.35,28.65 259.4,28.6
  Bottom 1.3: 329.4,32.7 274.4,32.7 271.47,35.63 260.78,35.63 259.35,34.2 | 329.4,32.7 329.5,32.6 | 329.4,32.7 334.6,32.7 337.9,29.4 354.5,29.4 358,32.9 441.8,32.9 444.9,29.8 460.5,29.8 463.4,32.7 483.9,32.7
  Bottom 1.5: J2.8 490.98,14.22 490.4,14.8 | C6.1 C5.1 490.4,26.2 483.9,32.7
  Bottom 2: J2.8 J2.7 J2.9 J2.10 J2.8
MCLR  (via drill 0.35)
  Top 0.3: v240.63,26.73 240.7,26.67 240.7,19.3 242.4,17.6 v249.4,17.6
  Bottom 0.3: v249.4,17.6 249.38,17.57 U6.1 | v240.63,26.73 239.76,26.73 J1.1
N$1  (via drill 0.35)
  other vias: 414.8,10.9
N$2  (via drill 0.35)
  other vias: 412.8,13.6
SYNC_IN  (via drill 0.35)
  Top 0.3: U5.2 492.25,23.75 492.25,20.65 v492.2,20.6
  Bottom 0.3: v492.2,20.6 492.3,20.7 492.3,28.2 493.56,29.46 J2.20
SYNC_OUT  (via drill 0.35)
  Top 0.3: v254,37.3 252.77,36.07 252.77,33.85 248.8,29.89 248.8,26.7 v248.7,26.6 | U5.3 488.98,25.02 487.7,26.3 487.7,32.5 483.5,36.7 v474.8,36.7
  Bottom 0.3: v254,37.3 254.2,37.5 259.2,37.5 260,38.3 473.2,38.3 v474.8,36.7 | v248.7,26.6 248.12,26.02 U6.14

### Text on the board
tPlace: ChoobMatrix | Kilian Dolan, Sam O'Mahony / Dublin Maker 2018